# Altium schematic sheet Power.SchDoc: main_assy PCB
size A4
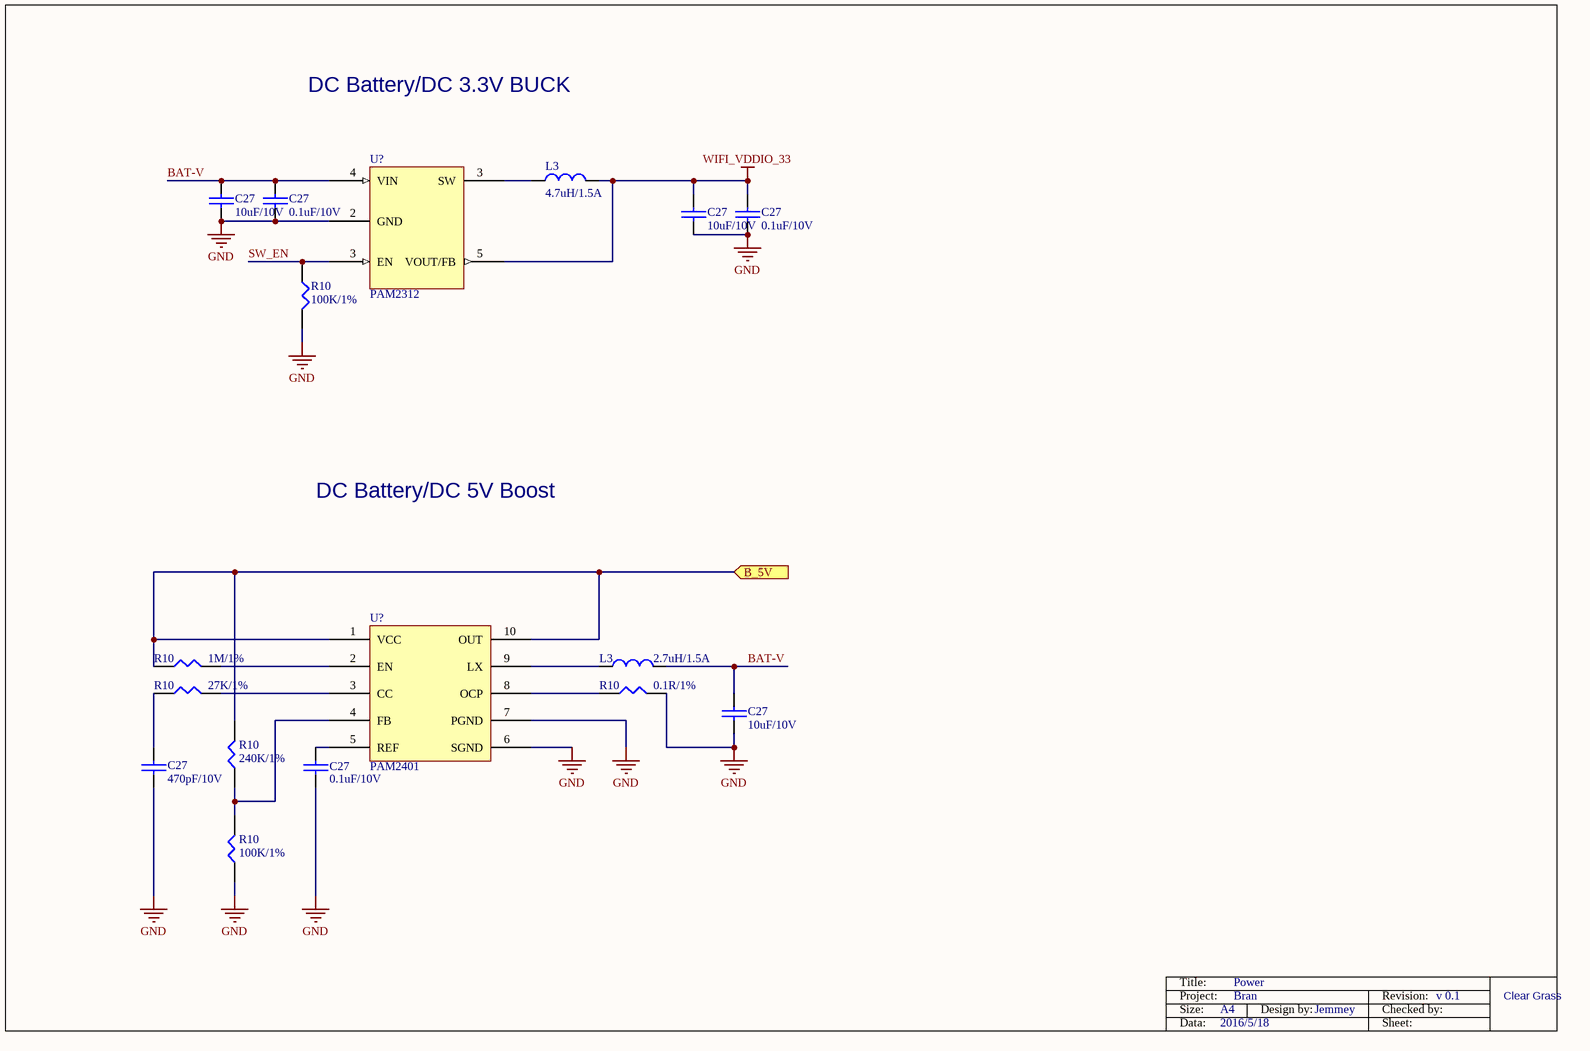
[diagram p0: Power.SchDoc]

## Parts
(Parts that share a designator on the sheet are numbered #1, #2 ... from top to bottom, then left to right.)
C27#1  10uF/10V  [0402C]
C27#2  0.1uF/10V  [0402C]
C27#3  10uF/10V  [0402C]
C27#4  0.1uF/10V  [0402C]
C27#5  10uF/10V  [0402C]
C27#6  470pF/10V  [0402C]
C27#7  0.1uF/10V  [0402C]
L3#1  4.7uH/1.5A  [Inductance]
L3#2  2.7uH/1.5A  [Inductance]
R10#1  100K/1%  [0402R]
R10#2  1M/1%  [0402R]
R10#3  27K/1%  [0402R]
R10#4  0.1R/1%  [0402R]
R10#5  240K/1%  [0402R]
R10#6  100K/1%  [0402R]
U?#1  PAM2312  [MOLEX_47590001]
U?#2  PAM2401  [MOLEX_47590001]

## Ports
B_5V (in)

## Nets
GND: C27#1.1 C27#2.1 C27#3.1 C27#4.1 C27#5.1 C27#6.1 C27#7.1 R10#1.2 R10#4.2 R10#6.1 U?#1.2(GND) U?#2.6(SGND) U?#2.7(PGND)
WIFI_VDDIO_33: C27#3.2 C27#4.2 L3#1.2 U?#1.5(VOUT/FB)
B_5V: R10#2.1 R10#5.2 U?#2.1(VCC) U?#2.10(OUT) ; port B_5V
BAT-V: C27#1.2 C27#2.2 C27#5.2 L3#2.2 U?#1.4(VIN)
SW_EN: R10#1.1 U?#1.3(EN)
NetC27#6_2: C27#6.2 R10#3.1
NetC27#7_2: C27#7.2 U?#2.5(REF)
NetL3#1_1: L3#1.1 U?#1.3(SW)
NetL3#2_1: L3#2.1 U?#2.9(LX)
NetR10#2_2: R10#2.2 U?#2.2(EN)
NetR10#3_2: R10#3.2 U?#2.3(CC)
NetR10#4_1: R10#4.1 U?#2.8(OCP)
NetR10#5_1: R10#5.1 R10#6.2 U?#2.4(FB)

## Notes on the sheet
- DC Battery/DC 3.3V BUCK
- DC Battery/DC 5V Boost
- Title:
- Power
- Project:
- Size:
- Data:
- A4
- 2016/5/18
- Bran
- Design by:
- Jemmey
- Revision:
- Sheet:
- Checked by:
- v 0.1
- Clear Grass

## Library data of the parts
C27#1-C27#7 = CAP: 厂家：Murata，型号：GRM155R71A104KA01D
L3#1 L3#2 = CHOKE
R10#1-R10#6 = RES1: 厂家：Yageo，型号：RC0402FR-0710KL
U?#1 = P: 厂家：Diodes，型号：PAM2312TSOT255330; Manuf_1: MOLEX; Manuf_Part_1: 475900001; Ordered by: Subcon; Silkscreen: USB USER
U?#2 = PAM: 厂家：Diodes，型号：PAM2401YPADJ; Manuf_1: MOLEX; Manuf_Part_1: 475900001; Ordered by: Subcon; Silkscreen: USB USER